# EAGLE schematic avr_g1000l_24 (EAGLE 9.4.0)
S12 replaced for test, footprint much larger -> proofprint first! all JTP1138 switches new footprint & 3D package v11 added C9 to VREF v20 swapped USB D+/D-, corrected S17 pins
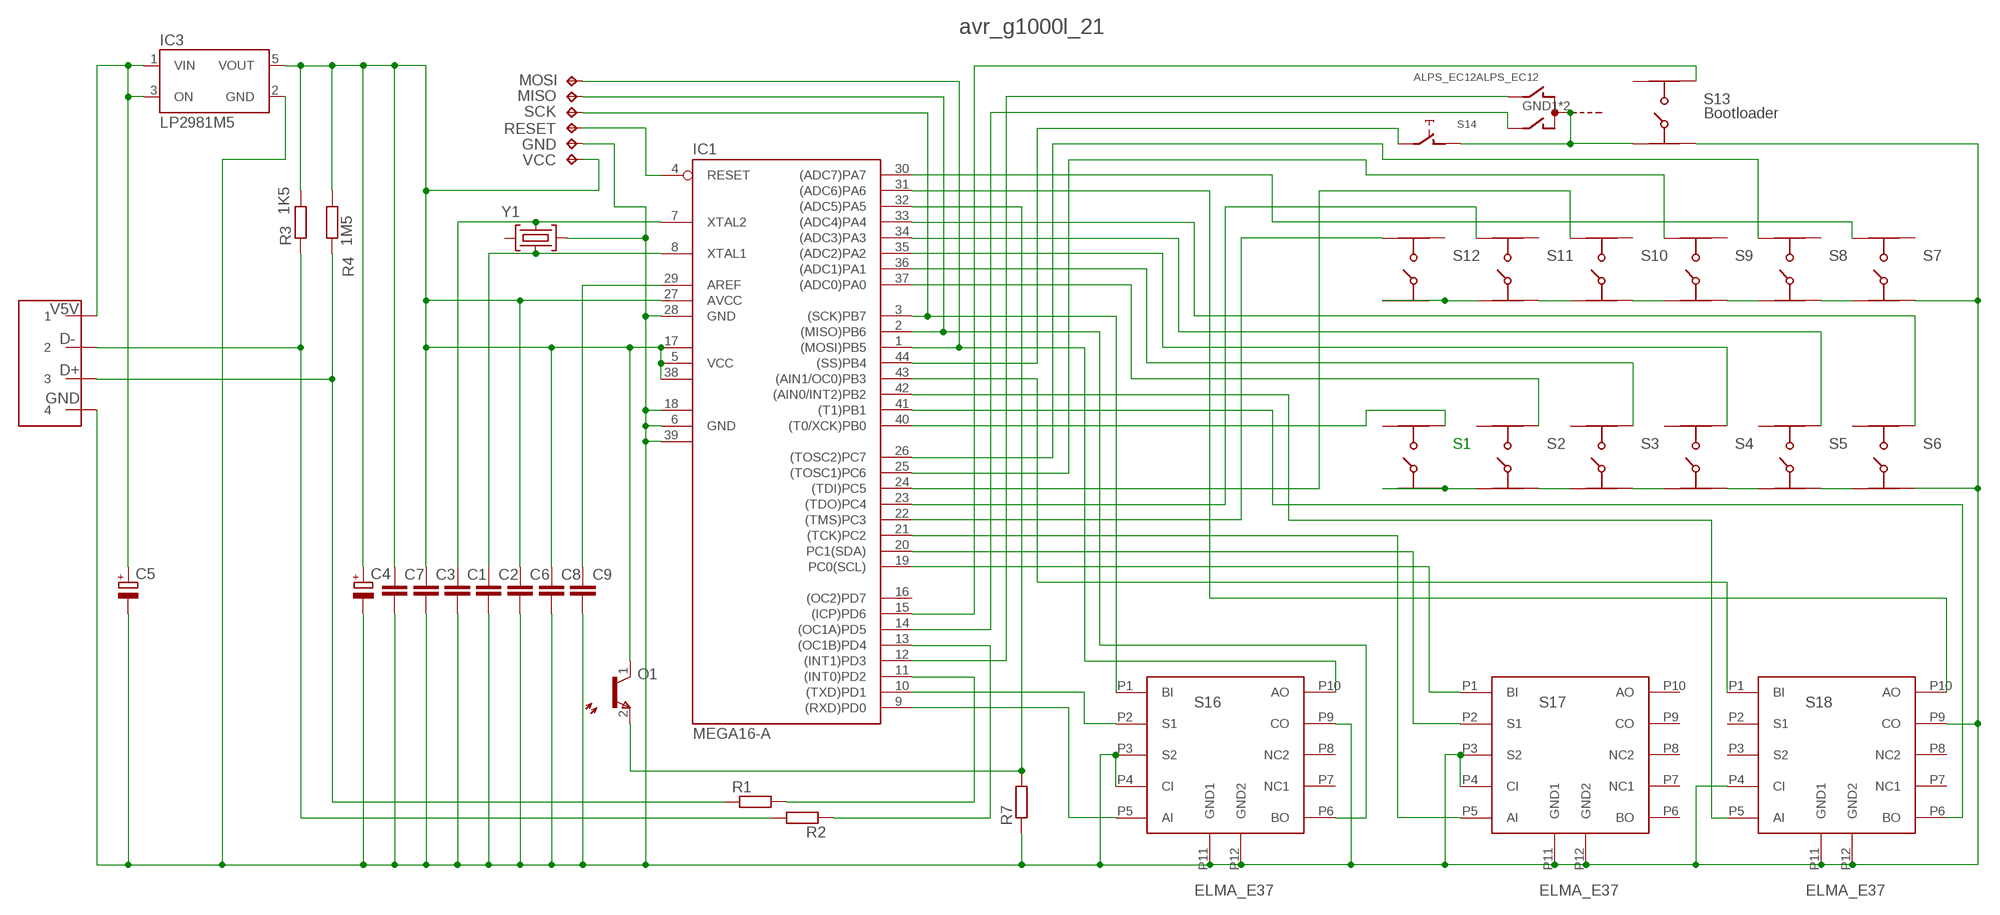
[diagram p0: schematic, sheet 1]

## Parts
C1  C-EUC0402  [C0402]
C2  C-EUC0402  [C0402]
C3  C-EUC0402  [C0402]
C4  CPOL-EUSMCA  [SMC_A]
C5  CPOL-EUSMCA  [SMC_A]
C6  C-EUC0402  [C0402]
C7  C-EUC0402  [C0402]
C8  C-EUC0402  [C0402]
C9  C-EUC0402  [C0402]
GND  TPTP10R  [TP10R]
IC1  MEGA16-A  [TQFP44]
IC3  LP2981M5  [SOT23-5]
MISO  TPTP10R  [TP10R]
MOSI  TPTP10R  [TP10R]
O1  KPS-3227KPS-3227  [RESC3216X110]
R1  R-EU_R0603  [R0603]
R2  R-EU_R0603  [R0603]
R3  1K5  R-EU_R0603  [R0603]
R4  1M5  R-EU_R0603  [R0603]
R7  R-EU_R0603  [R0603]
RESET  TPTP10R  [TP10R]
S1  B3FS1000  [B3FS1000]
S2  B3FS1000  [B3FS1000]
S3  B3FS1000  [B3FS1000]
S4  B3FS1000  [B3FS1000]
S5  B3FS1000  [B3FS1000]
S6  B3FS1000  [B3FS1000]
S7  B3FS1000  [B3FS1000]
S8  B3FS1000  [B3FS1000]
S9  B3FS1000  [B3FS1000]
S10  B3FS1000  [B3FS1000]
S11  B3FS1000  [B3FS1000]
S12  B3FS1000  [B3FS1000]
S13  B3FS1000  [B3FS1000]
S14  ALPS_EC12ALPS_EC12  [ALPS_EC12E_SW]
S16  ELMA_E37  [ELMA_E37]
S17  ELMA_E37  [ELMA_E37]
S18  ELMA_E37  [ELMA_E37]
SCK  TPTP10R  [TP10R]
U$4  HEADER4X1.27  [HEADER4X1.27]
VCC  TPTP10R  [TP10R]
Y1  MJ-CRYSTALMJ  [OSCCC500X320X100]

## Nets
D+: R2.2 R3.1 U$4.P2
D-: R1.1 R4.1 U$4.P3
GND [GND]: C1.2 C2.2 C3.2 C4.- C5.- C6.2 C7.2 C8.2 C9.2 GND.TP IC1.6(GND) IC1.18(GND1) IC1.28(GND) IC1.39(GND2) IC3.2(GND) R7.1 S1.3 S1.4 S2.3 S2.4 S3.3 S3.4 S4.3 S4.4 S5.3 S5.4 S6.3 S6.4 S7.3 S7.4 S8.3 S8.4 S9.3 S9.4 S10.3 S10.4 S11.3 S11.4 S12.3 S12.4 S13.3 S13.4 S14.C S14.D S14.GND1(G) S14.GND2(G) S16.P3(S2) S16.P4(CI) S16.P9(CO) S16.P11(GND1) S16.P12(GND2) S17.P3(S2) S17.P4(CI) S17.P11(GND1) S17.P12(GND2) S18.P4(CI) S18.P9(CO) S18.P11(GND1) S18.P12(GND2) U$4.P4 Y1.2(GND1)
PA0: IC1.37((ADC0)PA0) S2.2
PA1: IC1.36((ADC1)PA1) S3.2
PA2: IC1.35((ADC2)PA2) S4.2
PA3: IC1.34((ADC3)PA3) S5.2
PA4: IC1.33((ADC4)PA4) S6.2
PA5: IC1.32((ADC5)PA5) O1.2(E) R7.2
PA6: IC1.31((ADC6)PA6) S18.P10(AO)
PA7: IC1.30((ADC7)PA7) S7.1
PB0: IC1.40((T0/XCK)PB0) S1.2
PB1: IC1.41((T1)PB1) S18.P6(BO)
PB2: IC1.42((AIN0/INT2)PB2) S18.P5(AI)
PB3: IC1.43((AIN1/OC0)PB3) S18.P1(BI)
PB4: IC1.44((SS)PB4) S14.E
PB5: IC1.3((SCK)PB7) S16.P1(BI) SCK.TP
PB6: IC1.1((MOSI)PB5) MOSI.TP S16.P10(AO)
PB7: IC1.2((MISO)PB6) MISO.TP S16.P6(BO)
PC0: IC1.19(PC0(SCL)) S17.P1(BI)
PC1: IC1.20(PC1(SDA)) S17.P2(S1)
PC2: IC1.21((TCK)PC2) S17.P5(AI)
PC3: IC1.22((TMS)PC3) S12.1
PC4: IC1.23((TDO)PC4) S11.1
PC5: IC1.24((TDI)PC5) S10.1
PC6: IC1.25((TOSC1)PC6) S9.1
PC7: IC1.26((TOSC2)PC7) S8.1
PD0: IC1.9((RXD)PD0) S16.P5(AI)
PD1: IC1.10((TXD)PD1) S16.P2(S1)
PD2: IC1.13((OC1B)PD4) R2.1
PD3: IC1.12((INT1)PD3) S14.B
PD4: IC1.11((INT0)PD2) R1.2
PD5: IC1.14((OC1A)PD5) S14.A
PD6: IC1.15((ICP)PD6) S13.2
RESET: IC1.4(RESET) RESET.TP
V5V: C5.+ IC3.1(VIN) IC3.3(ON) U$4.P1
VCC: C3.1 C4.+ C6.1 C7.1 C8.1 IC1.5(VCC) IC1.17(VCC1) IC1.27(AVCC) IC1.38(VCC2) IC3.5(VOUT) O1.1(C) R3.2 R4.2 VCC.TP
VREF: C9.1 IC1.29(AREF)
XTAL1: C2.1 IC1.8(XTAL1) Y1.3(CRYSTAL2)
XTAL2: C1.1 IC1.7(XTAL2) Y1.1(CRYSTAL1)
Unconnected: IC1.16((OC2)PD7) S1.1 S2.1 S3.1 S4.1 S5.1 S6.1 S7.2 S8.2 S9.2 S10.2 S11.2 S12.2 S13.1 S16.P7(NC1) S16.P8(NC2) S17.P6(BO) S17.P7(NC1) S17.P8(NC2) S17.P9(CO) S17.P10(AO) S18.P2(S1) S18.P3(S2) S18.P7(NC1) S18.P8(NC2) Y1.4(GND2)

## Notes on the sheet
- avr_g1000l_21
- Bootloader

## Library data of the parts
C1-C3 C6-C9 = rcl:C-EU: CAPACITOR, European symbol; SPICEPREFIX: C
C4 C5 = rcl:CPOL-EU: POLARIZED CAPACITOR, European symbol; SPICEPREFIX: C
GND MISO MOSI RESET SCK VCC = testpad:TP: Test pad
IC1 = atmel:MEGA16: MICROCONTROLLER 16 Kbytes FLASH 1 kbytes SRAM 512 bytes EEPROM USART 8-channel 10 bit ADC Source: avr.lbr; MPN: ATMEGA16-16AU; OC_FARNELL: 9171134; OC_NEWARK: 96K6515
IC3 = v-reg-3:LP2981: National Semiconductor <http://www.national.com> Micropower Linear Regulator 100mA regulated output, Vin 16V max., ultra-low dropout of 200mV @ 100mA, 1µA standby current
O1 = kps-3227:KPS-3227
R1-R4 R7 = rcl:R-EU_: RESISTOR, European symbol; SPICEPREFIX: R
S1 = omron b3fs1000:B3FS1000; SPICEPREFIX: S
S2-S13 = omron b3fs1000:B3FS1000
S14 = alps_ec12:ALPS_EC12
S16-S18 = elma e37:ELMA_E37
U$4 = header4x1.27:HEADER4X1.27
Y1 = euroquartz:MJ-CRYSTAL: Miniature size: 5.0mm x 3.2mm x 1.0mm height

## Net classes
0 default: width 0.15 mm, clearance 0.15 mm
1 GND: width 0.3 mm, clearance 0.15 mm